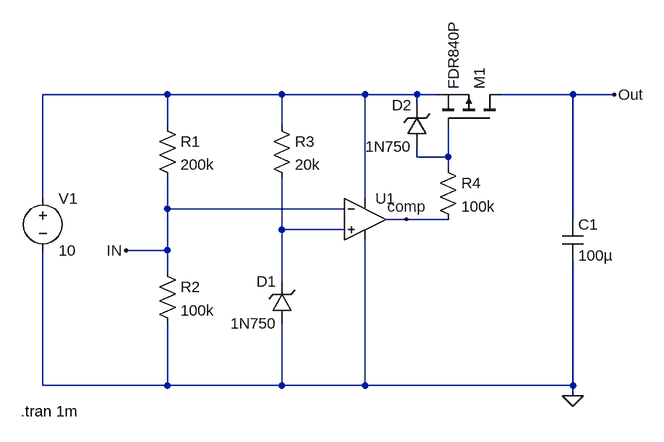
[diagram p0: schematic Overvoltage Protection.asc]
Overvoltage Protection.asc, the LTspice schematic file:
Version 4
SHEET 1 1704 680
WIRE 144 -16 -48 -16
WIRE 320 -16 144 -16
WIRE 448 -16 320 -16
WIRE 528 -16 448 -16
WIRE 560 -16 528 -16
WIRE 768 -16 656 -16
WIRE 832 -16 768 -16
WIRE 528 0 528 -16
WIRE 144 32 144 -16
WIRE 320 32 320 -16
WIRE 528 80 528 64
WIRE 576 80 576 32
WIRE 576 80 528 80
WIRE 576 96 576 80
WIRE -48 144 -48 -16
WIRE 448 144 448 -16
WIRE 144 160 144 112
WIRE 416 160 144 160
WIRE 512 176 480 176
WIRE 576 176 512 176
WIRE 768 176 768 -16
WIRE 320 192 320 112
WIRE 416 192 320 192
WIRE 144 224 144 160
WIRE 144 224 80 224
WIRE 144 256 144 224
WIRE 320 272 320 192
WIRE -48 432 -48 224
WIRE 144 432 144 336
WIRE 144 432 -48 432
WIRE 320 432 320 336
WIRE 320 432 144 432
WIRE 448 432 448 208
WIRE 448 432 320 432
WIRE 768 432 768 240
WIRE 768 432 448 432
WIRE 768 448 768 432
FLAG 768 448 0
FLAG 832 -16 Out
FLAG 80 224 IN
FLAG 512 176 comp
SYMBOL voltage -48 128 R0
WINDOW 123 0 0 Left 0
WINDOW 39 0 0 Left 0
SYMATTR InstName V1
SYMATTR Value 10
SYMBOL res 128 16 R0
SYMATTR InstName R1
SYMATTR Value 200k
SYMBOL res 128 240 R0
SYMATTR InstName R2
SYMATTR Value 100k
SYMBOL res 304 16 R0
SYMATTR InstName R3
SYMATTR Value 20k
SYMBOL zener 336 336 R180
WINDOW 0 24 64 Left 2
WINDOW 3 24 0 Left 2
SYMATTR InstName D1
SYMATTR Value 1N750
SYMBOL OpAmps\\UniversalOpAmp 448 176 R0
SYMATTR InstName U1
SYMATTR Value2 Avol=1 GBW=10Meg Vos=0
SYMBOL res 560 80 R0
SYMATTR InstName R4
SYMATTR Value 100k
SYMBOL pmos 656 32 M270
SYMATTR InstName M1
SYMATTR Value FDR840P
SYMBOL cap 752 176 R0
SYMATTR InstName C1
SYMATTR Value 100µ
SYMBOL zener 544 64 R180
WINDOW 0 24 64 Left 2
WINDOW 3 24 0 Left 2
SYMATTR InstName D2
SYMATTR Value 1N750
TEXT -82 472 Left 2 !.tran 1m

The netlist it stands for:
* Overvoltage Protection.asc
V1 N001 0 10
R1 N001 IN 200k
R2 IN 0 100k
R3 N001 N003 20k
D1 0 N003 1N750
XU1 N003 IN N001 0 comp level1 Avol=1 GBW=10Meg Vos=0 En=0 Enk=0 In=0 Ink=0 Rin=500Meg  ; pins In+ In- V+ V- OUT
R4 N002 comp 100k
M1 Out N002 N001 N001 FDR840P
C1 Out 0 100µ
D2 N002 N001 1N750
.model D D
.lib standard.dio
.model NMOS NMOS
.model PMOS PMOS
.lib standard.mos
.tran 1m
.lib UniversalOpAmp1.lib
.backanno
.end